# EasyEDA schematic Schematic_Seatalk to TTL_2021-10-25.json
TITLE: Sheet_1; REV: 1.0; Date: 2021-10-25; Sheet: 1/1; Company: Your Company
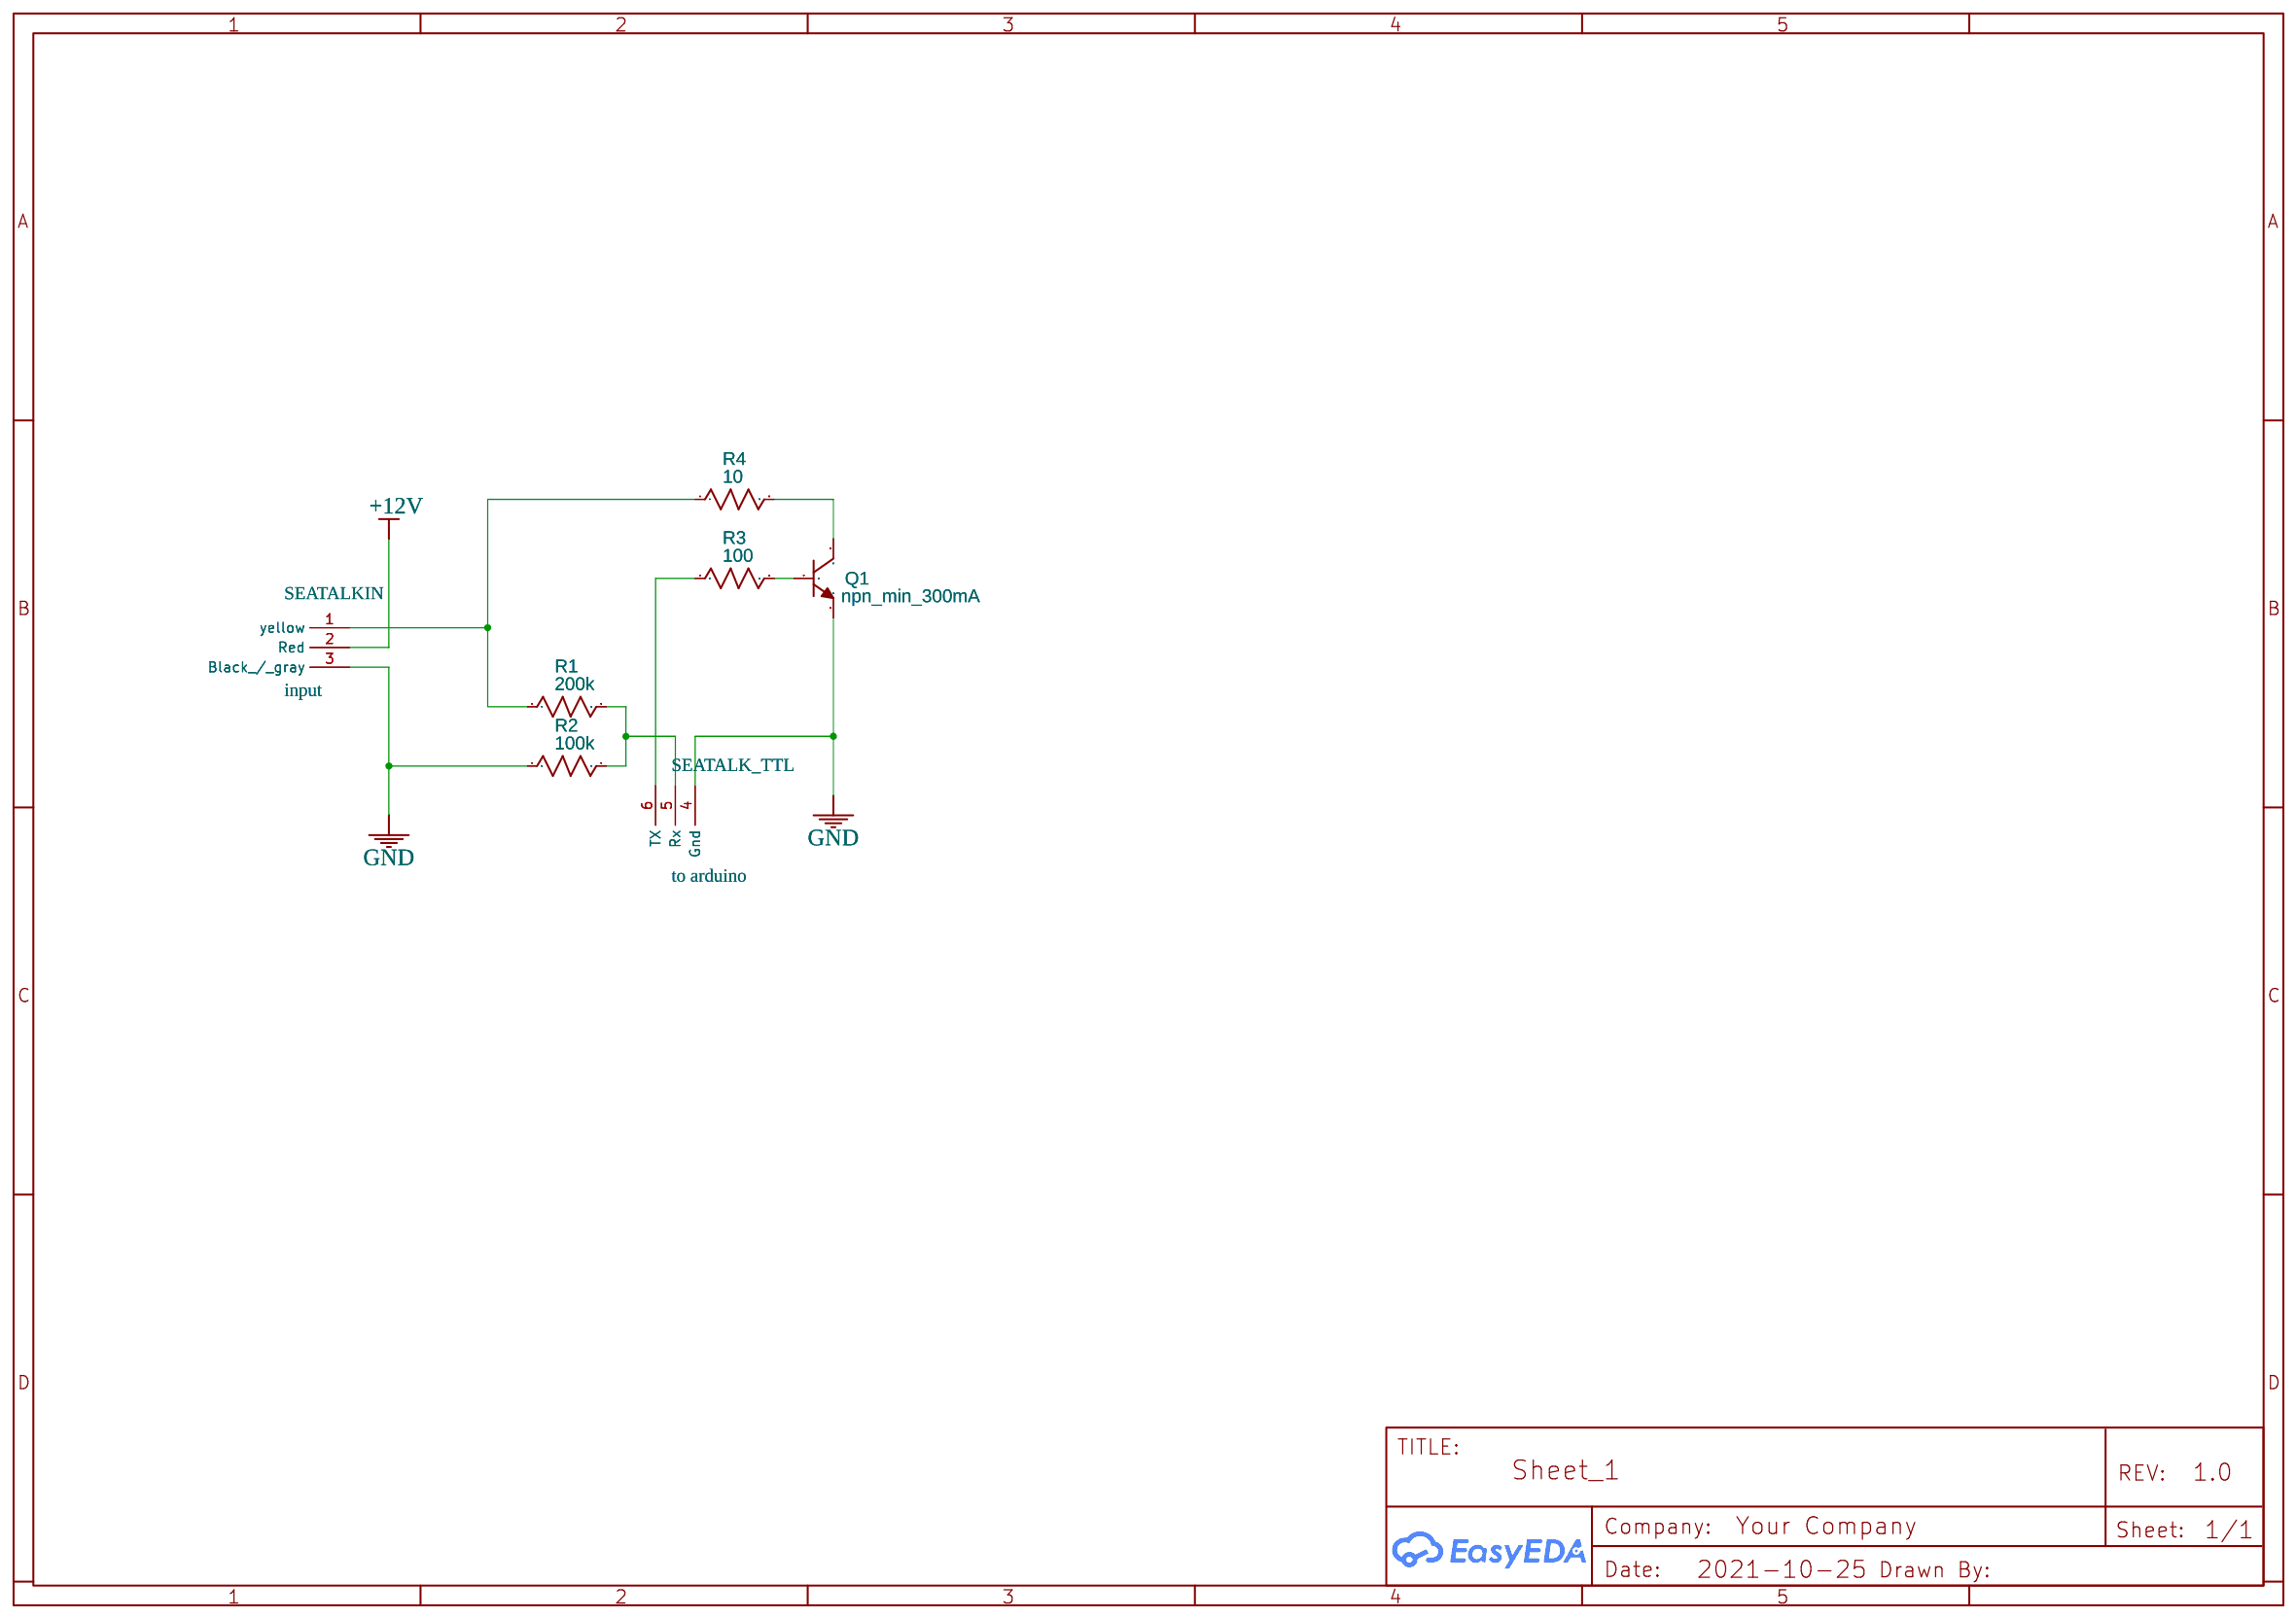
[diagram p0: schematic sheet]

## Parts
Q1  npn_min_300mA  [SOT-23-3_L2.9-W1.3-P1.90-LS2.4-TR]
R1  200k  [R0603]
R2  100k  [R0603]
R3  100  [R0603]
R4  10  [R0603]
SEATALK_TTL  to arduino
SEATALKIN  input

## Library data of the parts
Q1 = 2N3904(SOT-23): Supplier: LCSC; Manufacturer: KEC; Manufacturer Part: 2n3904S-RTK/PS; Supplier Part: C18536; Paste Type: SOT-23; Contributor: LCEDA_Lib
R1-R4 = R_0603_US: Contributor: LCEDA_Lib

## Nets
+12V: SEATALKIN.2(Red)
GND: Q1.1(E) R2.1 SEATALK_TTL.4(Gnd) SEATALKIN.3(Black / gray)
Net-(Q1-2): Q1.2(B) R3.2
Net-(Q1-3): Q1.3(C) R4.2
Net-(R1-1): R1.1 R4.1 SEATALKIN.1(yellow)
Net-(R1-2): R1.2 R2.2 SEATALK_TTL.5(Rx)
Net-(R3-1): R3.1 SEATALK_TTL.6(TX)
